# EAGLE schematic DIP09dat (EAGLE 5.00)

## Sheet 1 of 2
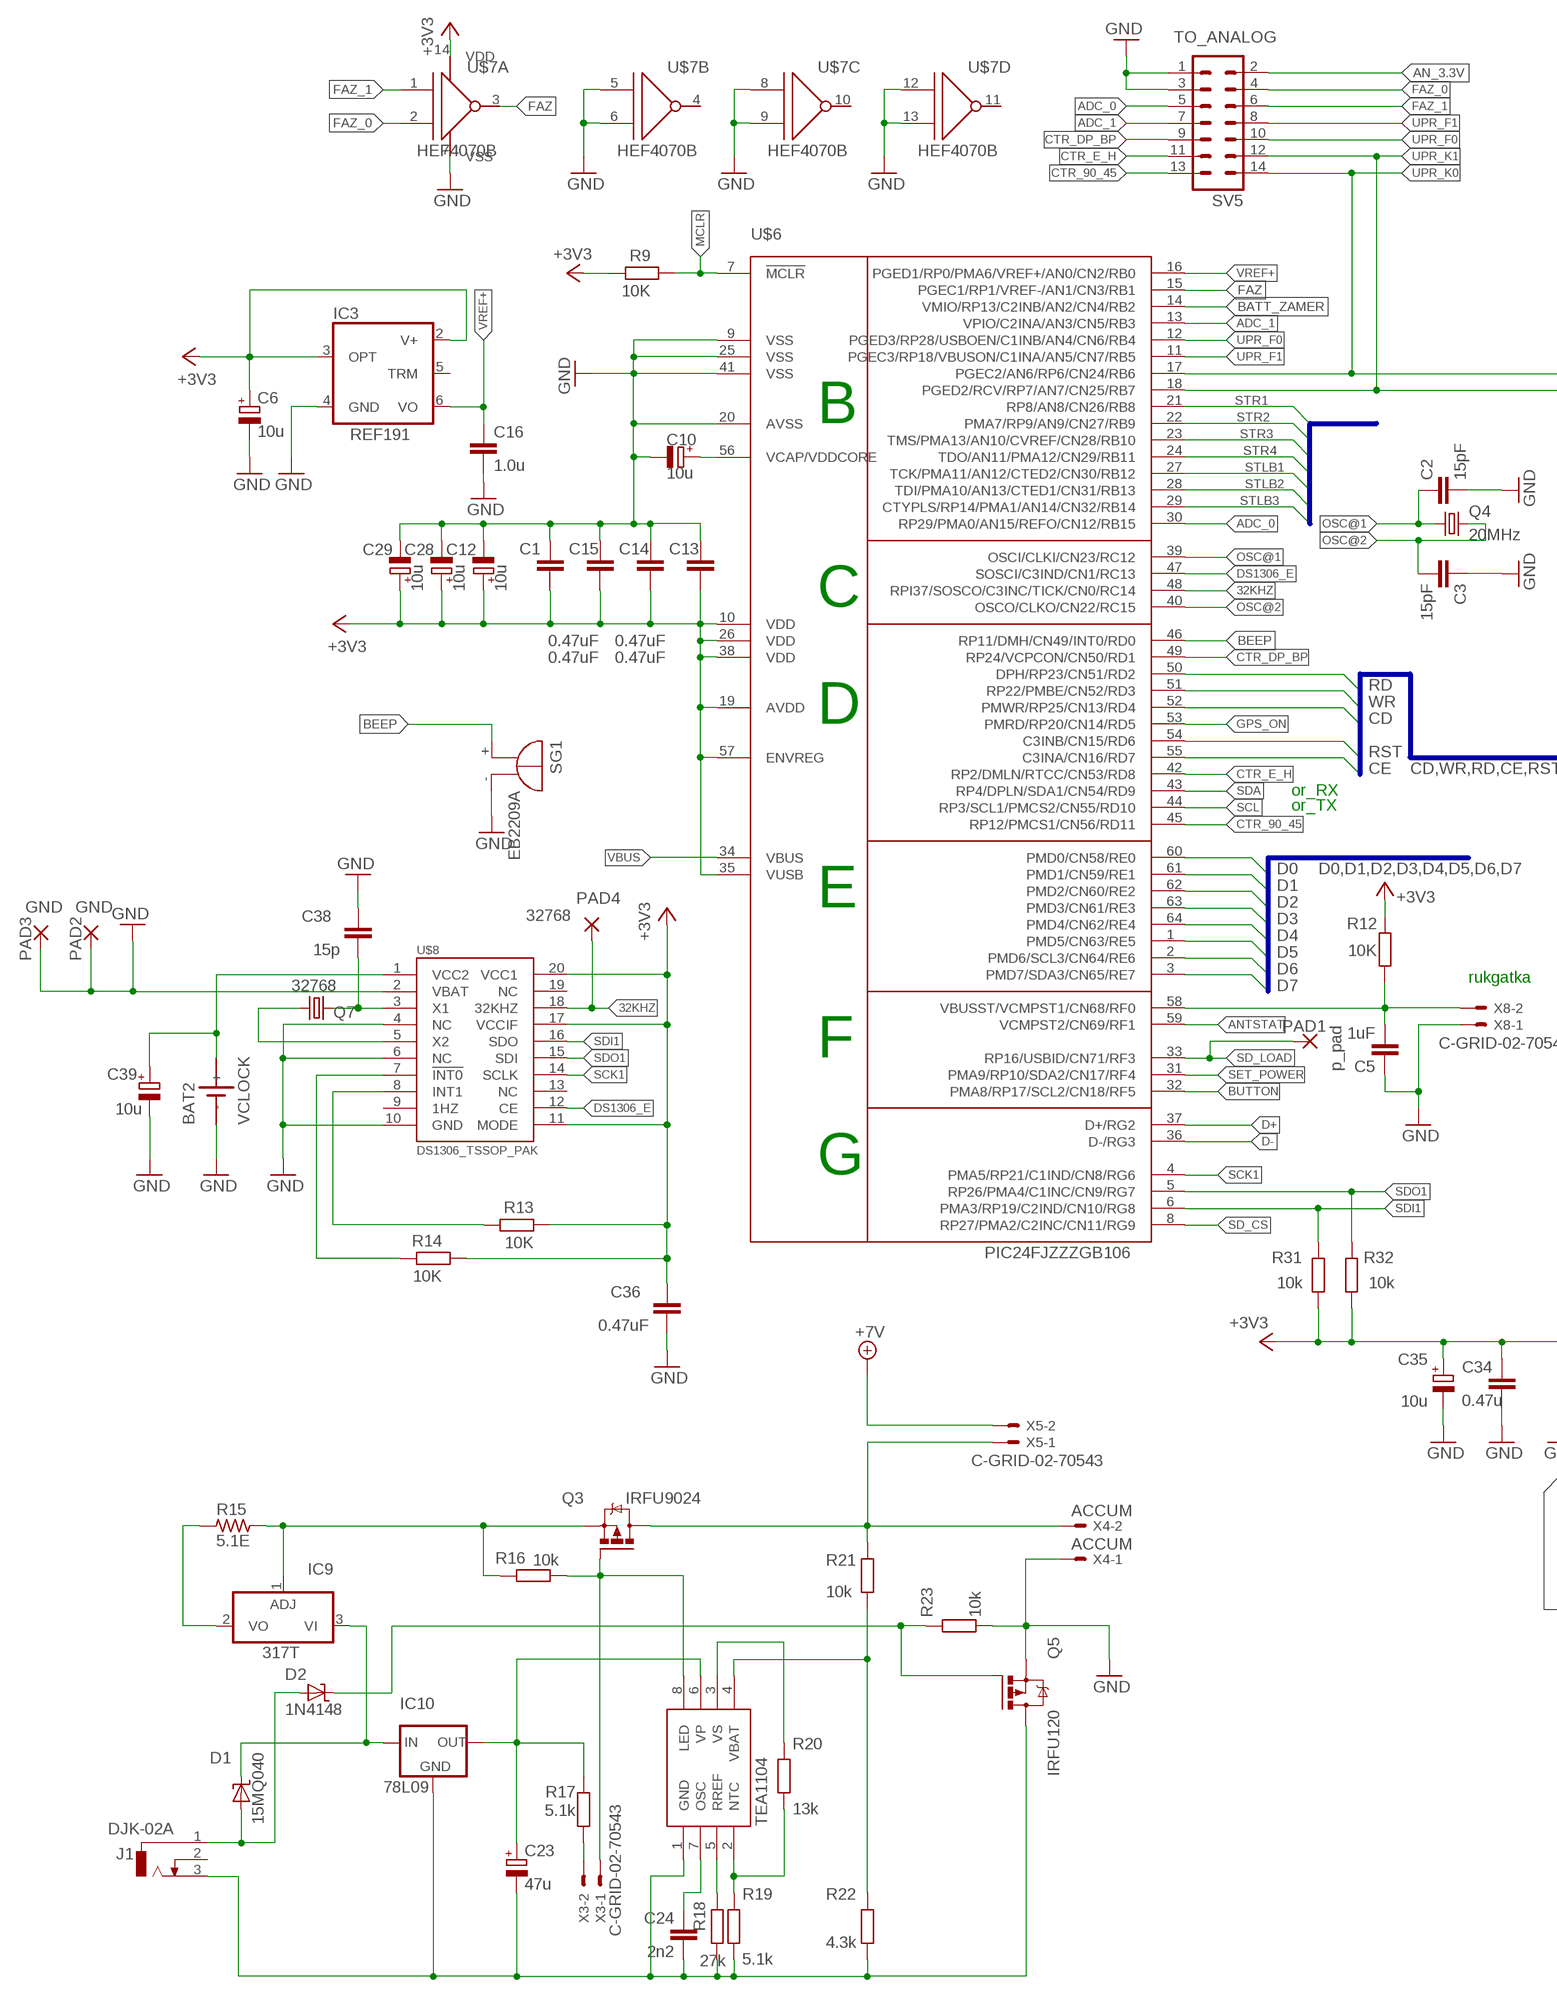
[diagram p0: schematic, sheet 1, part 1 of 2]
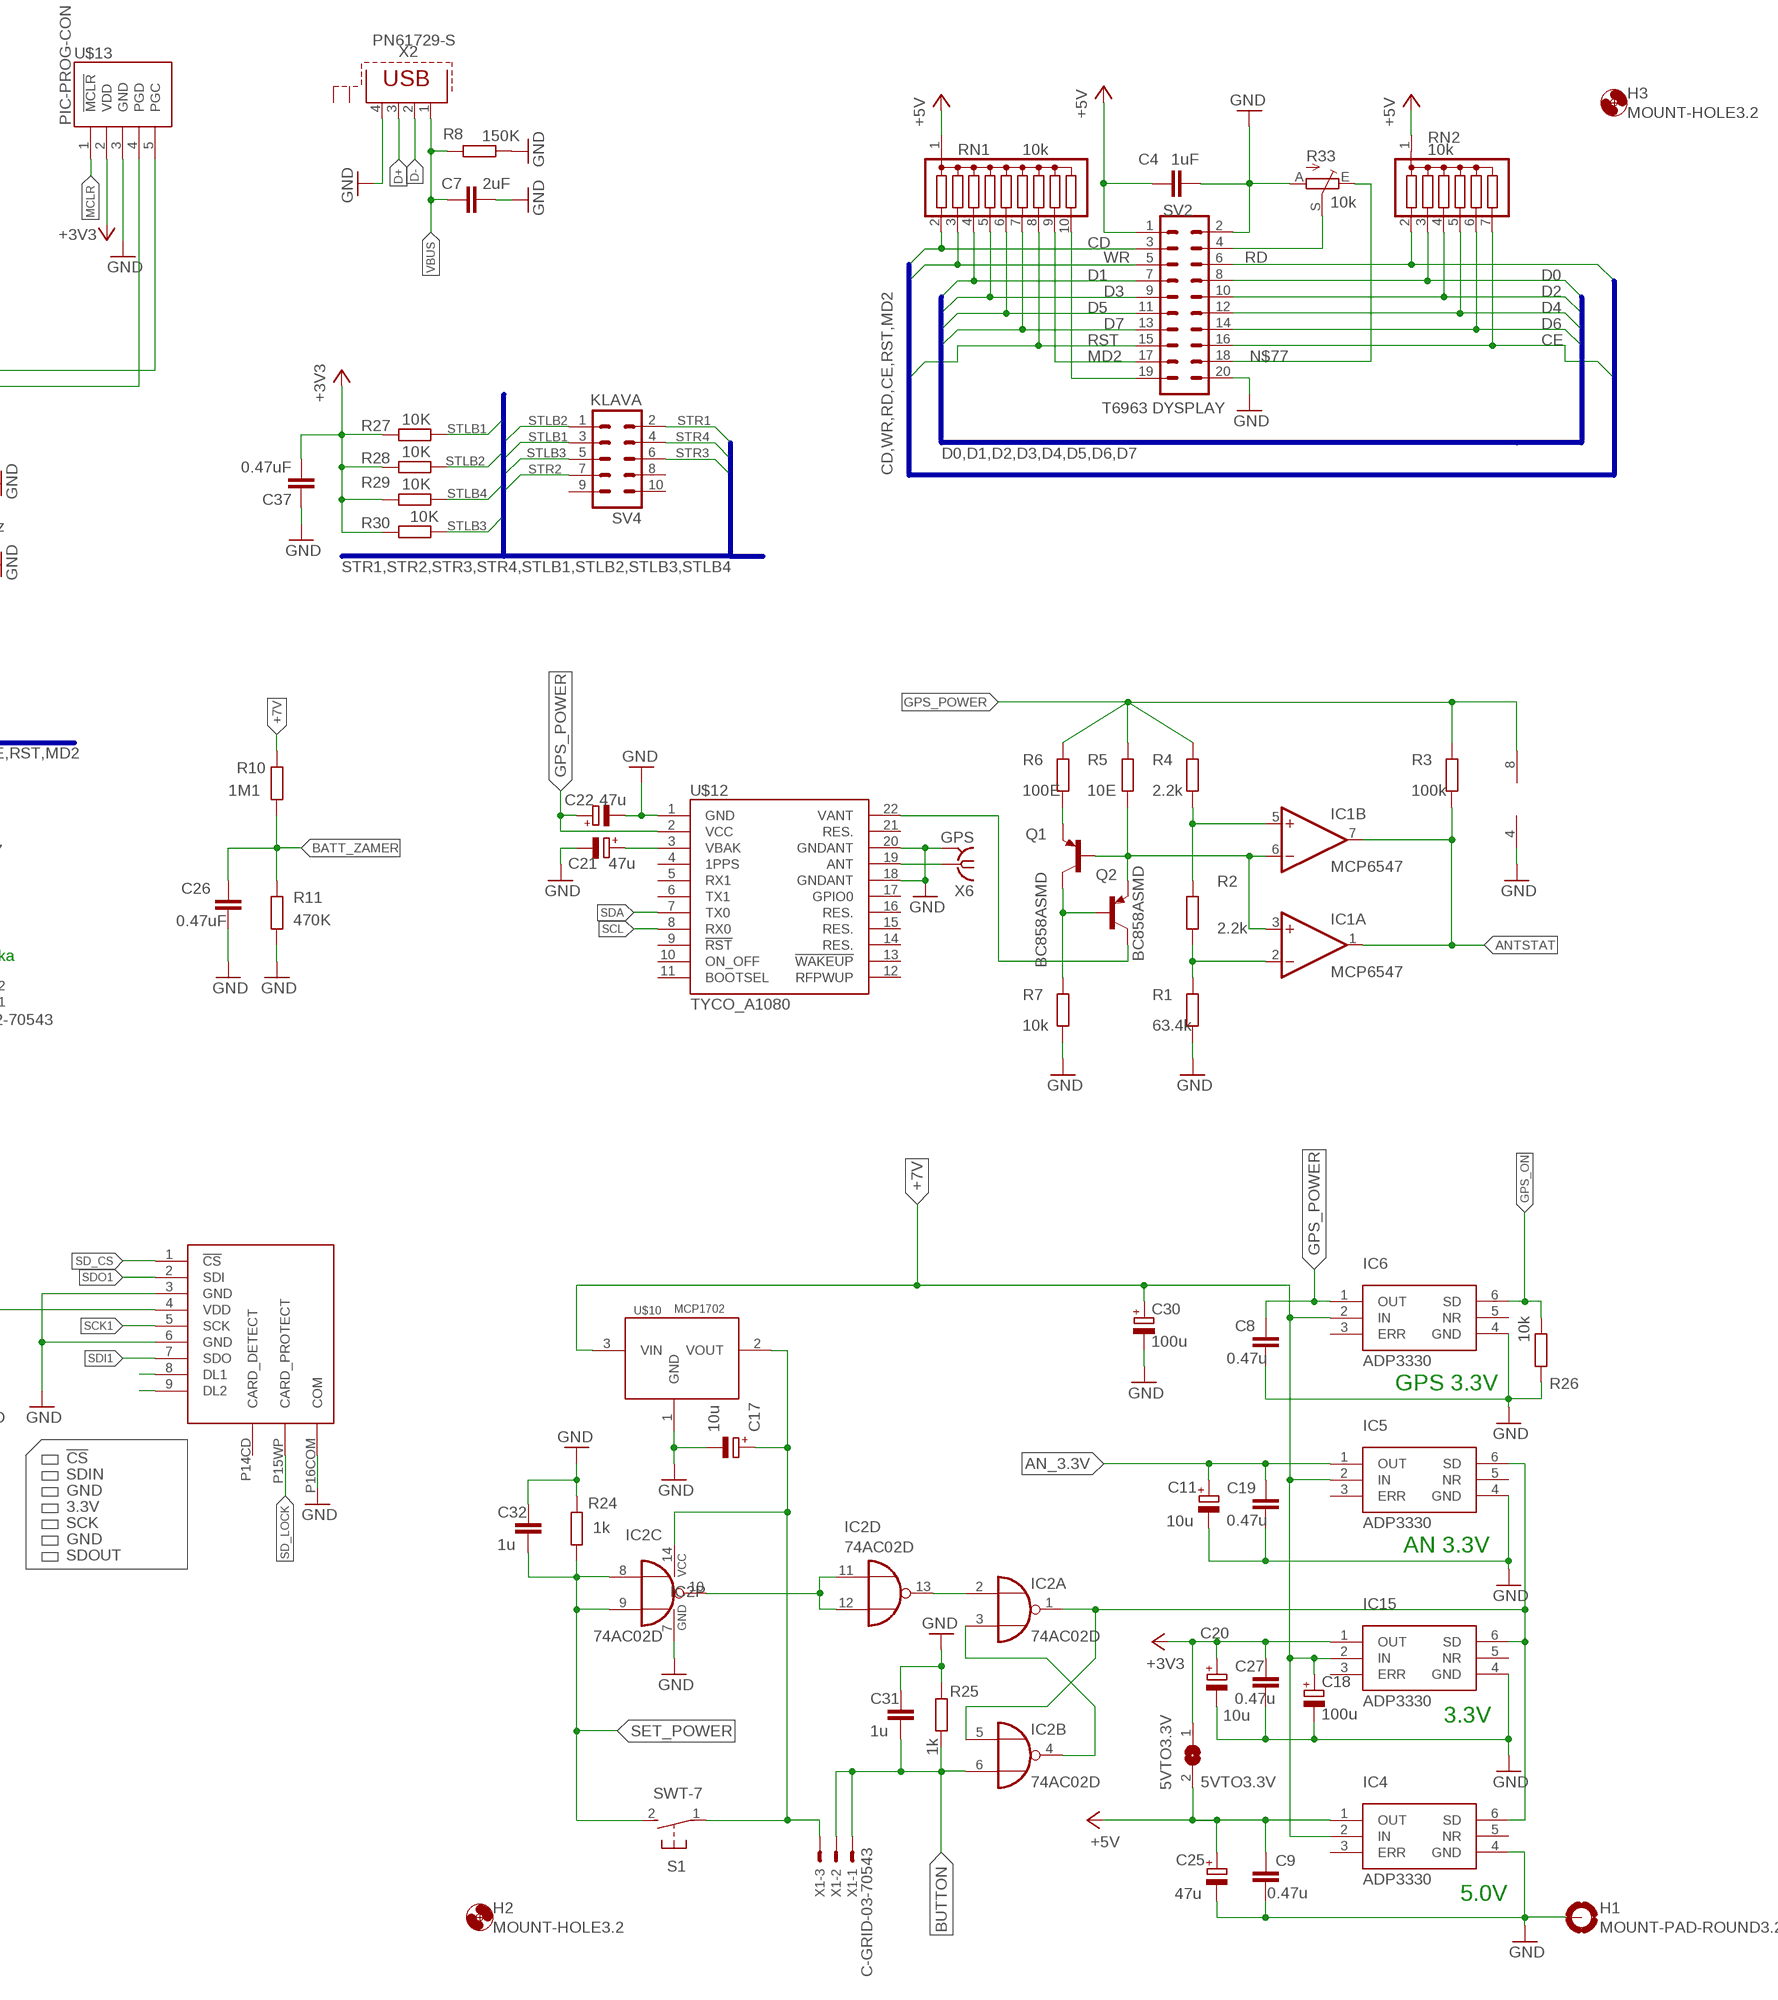
[diagram p1: schematic, sheet 1, part 2 of 2]

### Parts
5VTO3.3V  5VTO3.3V  SJ  [SJ]
BAT2  VCLOCK  SN2032  [SN2032]
C1  0.47uF  C-1206  [C1206]
C2  15pF  C-1206  [C1206]
C3  15pF  C-1206  [C1206]
C4  1uF  C-1206  [C1206]
C5  1uF  C-1206  [C1206]
C6  10u  CPOL-EUCT3528  [CT3528]
C7  2uF  C-1206  [C1206]
C8  0.47u  C-EUC1206  [C1206]
C9  0.47u  C-EUC1206  [C1206]
C10  10u  CPOL-EUCT3528  [CT3528]
C11  10u  CPOL-EUCT3528  [CT3528]
C12  10u  CPOL-EUCT3528  [CT3528]
C13  0.47uF  C-1206  [C1206]
C14  0.47uF  C-1206  [C1206]
C15  0.47uF  C-1206  [C1206]
C16  1.0u  C-EUC1206  [C1206]
C17  10u  CPOL-EUCT3528  [CT3528]
C18  100u  CPOL-EUCT7343  [CT7343]
C19  0.47u  C-EUC1206  [C1206]
C20  10u  CPOL-EUCT3528  [CT3528]
C21  47u  CPOL-EUCT3528  [CT3528]
C22  47u  CPOL-EUCT3528  [CT3528]
C23  47u  CPOL-EUCT3528  [CT3528]
C24  2n2  C-EUC1206  [C1206]
C25  47u  CPOL-EUCT3528  [CT3528]
C26  0.47uF  C-1206  [C1206]
C27  0.47u  C-EUC1206  [C1206]
C28  10u  CPOL-EUCT3528  [CT3528]
C29  10u  CPOL-EUCT3528  [CT3528]
C30  100u  CPOL-EUCT7343  [CT7343]
C31  1u  C-EUC1206  [C1206]
C32  1u  C-EUC1206  [C1206]
C34  0.47u  C-EUC1206  [C1206]
C35  10u  CPOL-EUCT3528  [CT3528]
C36  0.47uF  C-1206  [C1206]
C37  0.47uF  C-1206  [C1206]
C38  15p  C-1206  [C1206]
C39  10u  CPOL-EUCT3528  [CT3528]
D1  15MQ040  SUPPRESSOR-SMBJ  [SMBJ]
D2  1N4148  SUPPRESSOR-SMBJ  [SMBJ]
H1  MOUNT-PAD-ROUND3.2  [3,2-PAD]
H2  MOUNT-HOLE3.2  [3,2]
H3  MOUNT-HOLE3.2  [3,2]
IC1  MCP6547  LM393D  [SO08]
IC2  74AC02D  [SO14]
IC3  REF191  REF01D  [SO08]
IC4  ADP3330_5  ADP3330  [SOT-23-6]
IC5  ADP3330_3  ADP3330  [SOT-23-6]
IC6  ADP3330  [SOT-23-6]
IC9  317T  [TO220H]
IC10  78L09  78LXX  [78LXX]
IC11  TEA1104  [SOIC-8]
IC15  ADP3330_3  ADP3330  [SOT-23-6]
J1  DJK-02A  DCJ0303  [DCJ0303]
PAD1  p_pad  1,6/0,9  [1,6/0,9]
PAD2  GND  1,6/0,9  [1,6/0,9]
PAD3  GND  1,6/0,9  [1,6/0,9]
PAD4  32768  SMD2  [SMD1,27-2,54]
Q1  BC858ASMD  [SOT23-BEC]
Q2  BC858ASMD  [SOT23-BEC]
Q3  IRFU9024  IRFU5305  [I-PAK_TO251AA]
Q4  20MHz  CRYSTALHC49S  [HC49/S]
Q5  IRFU120  IRFU5305  [I-PAK_TO251AA]
Q7  32768  CRYSTALTC38H  [TC38H]
R1  63.4k  R-EU_M1206  [M1206]
R2  2.2k  R-EU_M1206  [M1206]
R3  100k  R-EU_M1206  [M1206]
R4  2.2k  R-EU_M1206  [M1206]
R5  10E  R-EU_M1206  [M1206]
R6  100E  R-EU_M1206  [M1206]
R7  10k  R-EU_M1206  [M1206]
R8  150K  R-R1206  [R1206]
R9  10K  R-R1206  [R1206]
R10  1M1  R-R1206  [R1206]
R11  470K  R-R1206  [R1206]
R12  10K  R-R1206  [R1206]
R13  10K  R-R1206  [R1206]
R14  10K  R-R1206  [R1206]
R15  5.1E  R_X0207/10B  [0207/10B]
R16  10k  R-EU_M1206  [M1206]
R17  5.1k  R-EU_M1206  [M1206]
R18  27k  R-EU_M1206  [M1206]
R19  5.1k  R-EU_M1206  [M1206]
R20  13k  R-EU_M1206  [M1206]
R21  10k  R-EU_M1206  [M1206]
R22  4.3k  R-EU_M1206  [M1206]
R23  10k  R-EU_M1206  [M1206]
R24  1k  R-EU_M1206  [M1206]
R25  1k  R-EU_M1206  [M1206]
R26  10k  R-EU_M1206  [M1206]
R27  10K  R-R1206  [R1206]
R28  10K  R-R1206  [R1206]
R29  10K  R-R1206  [R1206]
R30  10K  R-R1206  [R1206]
R31  10k  R-EU_M1206  [M1206]
R32  10k  R-EU_M1206  [M1206]
R33  10k  TRIM_EU-RJ6  [RJ6]
RN1  10k  G09R  [SIL10]
RN2  10k  G06R  [SIL7]
S1  SWT-7  31-XX  [B3F-31XX]
SG1  EB2209A  [EB2209A]
SV2  T6963 DYSPLAY  ML20  [ML20]
SV4  KLAVA  ML10  [ML10]
SV5  TO_ANALOG  ML14  [ML14]
U$6  PIC24FJZZZGB106  [TQFP-64-PT-0.5MM]
U$7  HEF4070B  [SO14]
U$8  DS1306_TSSOP_PAK  [TSSOP_20]
U$10  MCP1702  [SOT-23]
U$11  HRS_DM1A  [DM1A]
U$12  TYCO_A1080  [A1080]
U$13  PIC-PROG-CON  [PIC-PROG-CON]
X1  C-GRID-03-70543  [70543-03]
X2  PN61729-S  [PN61729-S]
X3  C-GRID-02-70543  [70543-02]
X4  ACCUM  KK-156-2  [KK-156-2]
X5  C-GRID-02-70543  [70543-02]
X6  GPS  BU-SMB-H  [BU-SMB-H]
X8  C-GRID-02-70543  [70543-02]

### Nets
32KHZ [net8]: PAD4.1(P) U$6.48(RPI37/SOSCO/C3INC/TICK/CN0/RC14) U$8.18(32KHZ)
+3V3 [net8]: 5VTO3.3V.1 C1.1 C6.+ C12.+ C13.1 C14.1 C15.1 C20.+ C27.1 C28.+ C29.+ C34.1 C35.+ C36.2 C37.2 IC3.2(V+) IC3.3(OPT) IC15.1(OUT) R9.2 R12.2 R13.1 R14.1 R27.2 R28.2 R29.2 R30.2 R31.1 R32.1 U$6.10(VDD) U$6.19(AVDD) U$6.26(VDD) U$6.35(VUSB) U$6.38(VDD) U$6.57(ENVREG) U$7.14(VDD) U$8.11(MODE) U$8.17(VCCIF) U$8.20(VCC1) U$11.4(VDD) U$13.2(VDD)
+5V: 5VTO3.3V.2 C4.1 C9.1 C25.+ IC4.1(OUT) RN1.1 RN2.1 SV2.1
+7V: C18.+ C30.+ IC4.2(IN) IC5.2(IN) IC6.2(IN) IC15.2(IN) R10.1 U$10.3(VIN) X5.2
ADC_0 [net8]: SV5.5 U$6.30(RP29/PMA0/AN15/REFO/CN12/RB15)
ADC_1 [net8]: SV5.7 U$6.13(VPIO/C2INA/AN3/CN5/RB3)
AN_3.3V: C11.+ C19.1 IC5.1(OUT) SV5.2
ANTSTAT [net8]: IC1.1(A:OUT) IC1.7(B:OUT) R3.2 U$6.59(VCMPST2/CN69/RF1)
BATT_ZAMER [net8]: C26.2 R10.2 R11.1 U$6.14(VMIO/RP13/C2INB/AN2/CN4/RB2)
BEEP [net8]: SG1.+ U$6.46(RP11/DMH/CN49/INT0/RD0)
BUTTON [net8]: C31.2 IC2.6(B:I1) R25.2 U$6.32(PMA8/RP17/SCL2/CN18/RF5) X1.1 X1.2
CD [net8]: RN1.2 SV2.3 U$6.52(PMWR/RP25/CN13/RD4)
CE [net8]: RN2.7 SV2.16 U$6.55(C3INA/CN16/RD7)
CTR_90_45 [net8]: SV5.13 U$6.45(RP12/PMCS1/CN56/RD11)
CTR_DP_BP [net8]: SV5.9 U$6.49(RP24/VCPCON/CN50/RD1)
CTR_E_H [net8]: SV5.11 U$6.42(RP2/DMLN/RTCC/CN53/RD8)
D0 [net8]: RN2.3 SV2.8 U$6.60(PMD0/CN58/RE0)
D1 [net8]: RN1.4 SV2.7 U$6.61(PMD1/CN59/RE1)
D2 [net8]: RN2.4 SV2.10 U$6.62(PMD2/CN60/RE2)
D3 [net8]: RN1.5 SV2.9 U$6.63(PMD3/CN61/RE3)
D4 [net8]: RN2.5 SV2.12 U$6.64(PMD4/CN62/RE4)
D5 [net8]: RN1.6 SV2.11 U$6.1(PMD5/CN63/RE5)
D6 [net8]: RN2.6 SV2.14 U$6.2(PMD6/SCL3/CN64/RE6)
D7 [net8]: RN1.7 SV2.13 U$6.3(PMD7/SDA3/CN65/RE7)
D+ [net8]: U$6.37(D+/RG2) X2.3
D- [net8]: U$6.36(D-/RG3) X2.2
DS1306_E [net8]: U$6.47(SOSCI/C3IND/CN1/RC13) U$8.12(CE)
FAZ [net8]: U$6.15(PGEC1/RP1/VREF-/AN1/CN3/RB1) U$7.3(A:O)
FAZ_0: SV5.4 U$7.2(A:I1)
FAZ_1: SV5.6 U$7.1(A:I0)
GND [net8]: BAT2.P$2(-) C1.2 C2.2 C3.1 C4.2 C5.1 C6.- C7.2 C8.2 C9.2 C10.- C11.- C12.- C13.2 C14.2 C15.2 C16.2 C17.- C18.- C19.2 C20.- C21.- C22.- C25.- C26.1 C27.2 C28.- C29.- C30.- C31.1 C32.1 C34.2 C35.- C36.1 C37.1 C38.2 C39.- H1.B3,2(MOUNT) IC1.4(P:V-) IC2.7(P:GND) IC3.4(GND) IC4.4(GND) IC5.4(GND) IC6.4(GND) IC15.4(GND) PAD2.1(P) PAD3.1(P) Q5.3(S) R1.2 R7.2 R8.1 R11.2 R23.2 R24.2 R25.1 R26.2 R33.A SG1.- SV2.2 SV2.20 SV5.1 SV5.3 U$6.9(VSS) U$6.20(AVSS) U$6.25(VSS) U$6.41(VSS) U$7.5(B:I0) U$7.6(B:I1) U$7.7(VSS) U$7.8(C:I0) U$7.9(C:I1) U$7.12(D:I0) U$7.13(D:I1) U$8.2(VBAT) U$8.4(NC) U$8.6(NC) U$8.10(GND) U$10.1(GND) U$11.3(GND) U$11.6(GND) U$11.P16COM(COM) U$12.1(GND) U$12.18(GNDANT) U$12.20(GNDANT) U$13.3(GND) X2.4 X4.1 X6.2(GND) X8.1
GPS_ON [net8]: IC6.6(SD) R26.1 U$6.53(PMRD/RP20/CN14/RD5)
GPS_POWER: C8.1 C22.+ IC1.8(P:V+) IC6.1(OUT) R3.1 R4.1 R5.1 R6.1 U$12.2(VCC)
MCLR [net8]: R9.1 U$6.7(!MCLR!) U$13.1(!MCLR)
MD2: RN1.9 SV2.17
N$1 [power]: D1.A D2.A J1.1
N$2 [net12]: C23.- C24.1 IC10.GND IC11.1(GND) J1.3 Q5.2(D) R18.1 R19.2 R22.2
N$3 [power]: IC9.1(ADJ) Q3.3(S) R15.2 R16.2
N$4 [power]: IC9.2(VO) R15.1
N$5 [power]: D1.C IC9.3(VI) IC10.IN
N$6: RN1.10 SV2.19
N$7 [net16]: C23.+ IC10.OUT IC11.6(VP) R17.2
N$8 [net16]: R17.1 X3.2
N$9 [net12]: IC11.8(LED) Q3.1(G) R16.1 X3.1
N$10: IC1.2(A:-IN) R1.1 R2.2
N$11: IC1.3(A:+IN) IC1.6(B:-IN) Q1.B Q2.E R5.2
N$12 [net8]: C5.2 R12.1 U$6.58(VBUSST/VCMPST1/CN68/RF0) X8.2
N$13: IC1.5(B:+IN) R2.1 R4.2
N$15 [net12]: C24.2 IC11.7(OSC)
N$16 [net12]: IC11.5(RREF) R18.2
N$17: Q1.E R6.2
N$18: Q1.C Q2.B R7.1
N$19: IC2.10(C:O) IC2.11(D:I0) IC2.12(D:I1)
N$20 [net8]: C10.+ U$6.56(VCAP/VDDCORE)
N$21: C38.1 Q7.2 U$8.3(X1)
N$22 [net12]: IC11.2(NTC) R19.1 R20.2
N$23: BAT2.P$1(+) C39.+ U$8.1(VCC2)
N$25: Q7.1 U$8.5(X2)
N$26: R13.2 U$8.8(INT1)
N$27 [net12]: D2.C Q5.1(G) R23.1
N$28: R14.2 U$8.7(!INT0)
N$29: IC2.3(A:I1) IC2.4(B:O)
N$30: IC2.2(A:I0) IC2.13(D:O)
N$32: C17.+ IC2.14(P:VCC) S1.1(P) U$10.2(VOUT) X1.3
N$33: IC2.1(A:O) IC2.5(B:I0) IC4.6(SD) IC5.6(SD) IC15.6(SD)
N$34: U$11.8(DL1)
N$35: U$11.9(DL2)
N$37: C21.+ U$12.3(VBAK)
N$38: U$12.19(ANT) X6.1
N$40 [net12]: IC11.3(VS) R20.1
N$41 [net12]: IC11.4(VBAT) R21.2 R22.1
N$42: Q3.2(D) R21.1 X4.2 X5.1
N$77: R33.E SV2.18
N$82: R33.S SV2.4
OSC@1 [net8]: C2.1 Q4.1 U$6.39(OSCI/CLKI/CN23/RC12)
OSC@2 [net8]: C3.2 Q4.2 U$6.40(OSCO/CLKO/CN22/RC15)
RD [net8]: RN2.2 SV2.6 U$6.50(DPH/RP23/CN51/RD2)
RST [net8]: RN1.8 SV2.15 U$6.54(C3INB/CN15/RD6)
SCK1 [net8]: U$6.4(PMA5/RP21/C1IND/CN8/RG6) U$8.14(SCLK) U$11.5(SCK)
SCL [net8]: U$6.44(RP3/SCL1/PMCS2/CN55/RD10) U$12.8(RX0)
SD_CS [net8]: U$6.8(RP27/PMA2/C2INC/CN11/RG9) U$11.1(!CS)
SD_LOAD [net8]: PAD1.1(P) U$6.33(RP16/USBID/CN71/RF3)
SD_LOCK: U$11.P15WP(CARD_PROTECT)
SDA [net8]: U$6.43(RP4/DPLN/SDA1/CN54/RD9) U$12.7(TX0)
SDI1 [net8]: R31.2 U$6.6(PMA3/RP19/C2IND/CN10/RG8) U$8.16(SDO) U$11.7(SDO)
SDO1 [net8]: R32.2 U$6.5(RP26/PMA4/C1INC/CN9/RG7) U$8.15(SDI) U$11.2(SDI)
SET_POWER [net8]: C32.2 IC2.8(C:I0) IC2.9(C:I1) R24.1 S1.2(S) U$6.31(PMA9/RP10/SDA2/CN17/RF4)
STLB1 [net8]: R27.1 SV4.3 U$6.27(TCK/PMA11/AN12/CTED2/CN30/RB12)
STLB2 [net8]: R28.1 SV4.1 U$6.28(TDI/PMA10/AN13/CTED1/CN31/RB13)
STLB3 [net8]: R30.1 SV4.5 U$6.29(CTYPLS/RP14/PMA1/AN14/CN32/RB14)
STLB4: R29.1
STR1 [net8]: SV4.2 U$6.21(RP8/AN8/CN26/RB8)
STR2 [net8]: SV4.7 U$6.22(PMA7/RP9/AN9/CN27/RB9)
STR3 [net8]: SV4.6 U$6.23(TMS/PMA13/AN10/CVREF/CN28/RB10)
STR4 [net8]: SV4.4 U$6.24(TDO/AN11/PMA12/CN29/RB11)
UPR_F0 [net8]: SV5.10 U$6.12(PGED3/RP28/USBOEN/C1INB/AN4/CN6/RB4)
UPR_F1 [net8]: SV5.8 U$6.11(PGEC3/RP18/VBUSON/C1INA/AN5/CN7/RB5)
UPR_K0 [net8]: SV5.14 U$6.17(PGEC2/AN6/RP6/CN24/RB6) U$13.5(PGC)
UPR_K1 [net8]: SV5.12 U$6.18(PGED2/RCV/RP7/AN7/CN25/RB7) U$13.4(PGD)
VANT: Q2.C U$12.22(VANT)
VBUS [net8]: C7.1 R8.2 U$6.34(VBUS) X2.1
VREF+ [net8]: C16.1 IC3.6(VO) U$6.16(PGED1/RP0/PMA6/VREF+/AN0/CN2/RB0)
WR [net8]: RN1.3 SV2.5 U$6.51(RP22/PMBE/CN52/RD3)
Unconnected: IC3.5(TRM) IC4.3(ERR) IC4.5(NR) IC5.3(ERR) IC5.5(NR) IC6.3(ERR) IC6.5(NR) IC15.3(ERR) IC15.5(NR) J1.2 SV4.8 SV4.9 SV4.10 U$7.4(B:O) U$7.10(C:O) U$7.11(D:O) U$8.9(1HZ) U$8.13(NC) U$8.19(NC) U$11.P14CD(CARD_DETECT) U$12.4(1PPS) U$12.5(RX1) U$12.6(TX1) U$12.9(!RST) U$12.10(ON_OFF) U$12.11(BOOTSEL) U$12.12(RFPWUP) U$12.13(!WAKEUP) U$12.14(RES.) U$12.15(RES.) U$12.16(RES.) U$12.17(GPIO0) U$12.21(RES.) X2.S1 X2.S2

### Buses
D0,D1,D2,D3,D4,D5,D6,D7
CD,WR,RD,CE,RST,MD2
STR1,STR2,STR3,STR4,STLB1,STLB2,STLB3,STLB4

### Notes on the sheet
- B
- C
- D
- or_RX
- or_TX
- E
- rukgatka
- F
- G
- GPS 3.3V
- !CS!
- SDIN
- GND
- 3.3V
- SCK
- GND
- AN 3.3V
- SDOUT
- 3.3V
- 5.0V

## Sheet 2 of 2

## Power pins joined to a net without a drawn wire
GND: X6.3(GND) X6.4(GND) X6.5(GND)

## Library data of the parts
5VTO3.3V = jumper:SJ: SMD solder JUMPER
BAT2 = sn2032:SN2032: LI BATTERY dip07
C1-C5 C7 C13-C15 C26 C36-C38 = quantum-sensor:C: Capacitor
C6 C10-C12 C17 C18 C20-C23 C25 C28-C30 C35 C39 = rcl:CPOL-EU: POLARIZED CAPACITOR, European symbol
C8 C9 C16 C19 C24 C27 C31 C32 C34 = rcl:C-EU: CAPACITOR, European symbol
D1 D2 = diode:SUPPRESSOR-: Suppressor diode
H1 = holes:MOUNT-PAD-ROUND: MOUNTING PAD, round
H2 H3 = holes:MOUNT-HOLE: MOUNTING HOLE with drill center marker
IC1 = linear:LM393: COMPARATOR
IC2 = 74xx-eu:74*02: Quad 2-input NOR gate
IC3 = linear:REF01: VOLTAGE REFERENCE
IC4-IC6 IC15 = raznoe01:ADP3330: adp3330
IC9 = linear:*317: Positive VOLTAGE REGULATOR
IC10 = v-reg:78LXX: VOLTAGE REGULATOR
IC11 = raznoe01:TEA1104: tea1104
J1 = con-jack:DCJ0303: DC POWER JACK Source: DCJ0303.pdf
PAD1-PAD3 = wirepad:1,6/0,9: THROUGH-HOLE PAD
PAD4 = wirepad:SMD2: SMD PAD
Q1 Q2 = transistor-pnp:BC858*: PNP Transistror
Q3 Q5 = transistor-power:IRF?5305: HEXFET Power MOSFET Source: http://www.irf.com/product-info/datasheets/data/irfr5305pbf.pdf
Q4 Q7 = crystal:CRYSTAL: CRYSTAL
R1-R7 R16-R26 R31 R32 = rcl:R-EU_: RESISTOR, European symbol
R8-R14 R27-R30 = quantum-sensor:R: Resistor
R15 = rc-master:R_: RESISTOR
R33 = pot:TRIM_EU-: POTENTIOMETER
RN1 = resistor-sil:G09R: SIL RESISTOR
RN2 = resistor-sil:G06R: SIL RESISTOR
S1 = switch-omron:31-XX: OMRON SWITCH
SG1 = buzzer:EB2209A: BUZZER Source: Buerklin
SV2 = con-harting-ml:ML20: HARTING
SV4 = con-ml:ML10: HARTING
SV5 = con-ml:ML14: HARTING
U$6 = microchip_pic24:PIC24FJZZZGB106: PIC24FJXXXGB106
U$7 = hef4070b:HEF4070B: CD4070B HEF4070B
U$8 = dallas-rtc:DS1306_TSSOP_PAK
U$10 = microchip_MCP17XX:MCP1702: MCP1702
U$11 = HRS_SD_SLOT:HRS_DM1A: HRS DM1A
U$12 = tyco_A1080:TYCO_A1080: tyco A1080
U$13 = pic_prog_con:PIC-PROG-CON: pic prog con pic_prog pic_prog_con
X1 = con-molex:C-GRID-03: CONNECTOR wire to board 2.54 mm (0.100") pitch header
X2 = con-berg:PN61729-S: BERG USB connector
X3 X5 X8 = con-molex:C-GRID-02: CONNECTOR wire to board 2.54 mm (0.100") pitch header
X4 = con-molex:KK-156-2: KK 156 HEADER Source: http://www.molex.com/pdm_docs/sd/026604100_sd.pdf
X6 = con-coax:BU-SMB-H: FEMALE SMB CONNECTOR Radiall distributor RS 112-3003

## Net classes
1 power: width 0.813 mm
2 net12: width 0.305 mm
3 power25: width 0.635 mm
4 power24: width 0.61 mm
5 net16: width 0.406 mm
6 net8: width 0.203 mm